# EAGLE design M7075X (EAGLE 6.6.0)
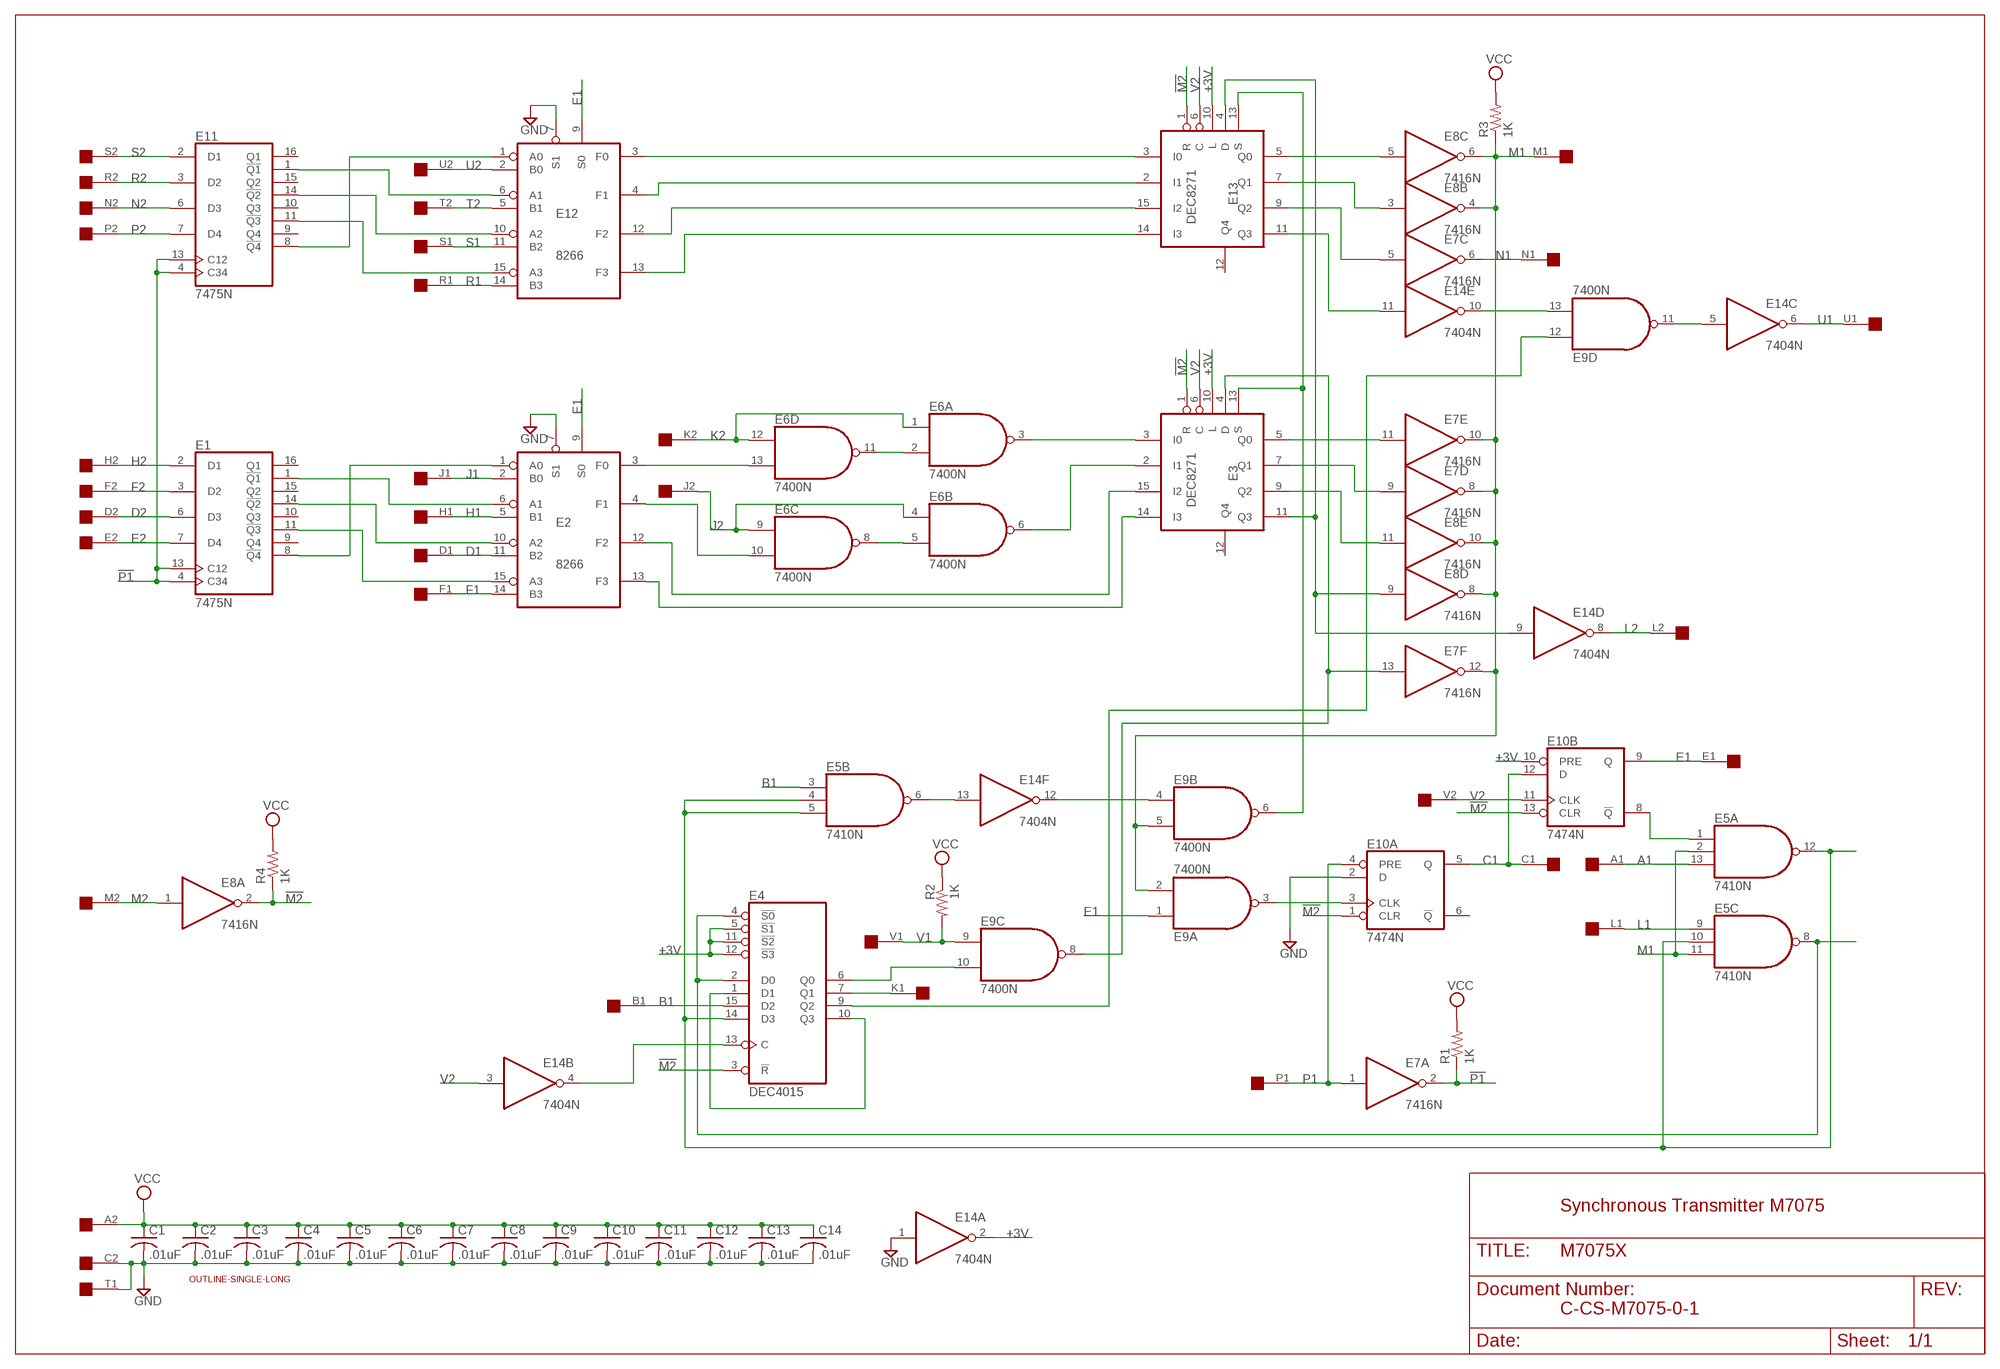
[diagram p0: schematic, sheet 1]

## Parts
C1  .01uF  C-US050-025X075  [C050-025X075]
C2  .01uF  C-US050-025X075  [C050-025X075]
C3  .01uF  C-US050-025X075  [C050-025X075]
C4  .01uF  C-US050-025X075  [C050-025X075]
C5  .01uF  C-US050-025X075  [C050-025X075]
C6  .01uF  C-US050-025X075  [C050-025X075]
C7  .01uF  C-US050-025X075  [C050-025X075]
C8  .01uF  C-US050-025X075  [C050-025X075]
C9  .01uF  C-US050-025X075  [C050-025X075]
C10  .01uF  C-US050-025X075  [C050-025X075]
C11  .01uF  C-US050-025X075  [C050-025X075]
C12  .01uF  C-US050-025X075  [C050-025X075]
C13  .01uF  C-US050-025X075  [C050-025X075]
C14  .01uF  C-US050-025X075  [C050-025X075]
E1  7475N  [DIL16]
E2  8266  [DIL16]
E3  DEC8271  [DIL16]
E4  DEC4015  [DIL16]
E5  7410N  [DIL14]
E6  7400N  [DIL14]
E7  7416N  [DIL14]
E8  7416N  [DIL14]
E9  7400N  [DIL14]
E10  7474N  74S74N  [DIL14]
E11  7475N  [DIL16]
E12  8266  [DIL16]
E13  DEC8271  [DIL16]
E14  7404N  [DIL14]
R1  1K  R-US_0207/10  [0207/10]
R2  1K  R-US_0207/10  [0207/10]
R3  1K  R-US_0207/10  [0207/10]
R4  1K  R-US_0207/10  [0207/10]
U$1  OUTLINE-SINGLE-LONG  [SINGLE-LONG]
U$2  SINGLE  [EDGE-CON2]

## Nets
!M2: E3.1(R) E4.3(!R) E8.2(A:O) E10.1(A:CLR) E10.13(B:CLR) E13.1(R) R4.1
!P1: E1.4(C34) E1.13(C12) E7.2(A:O) E11.4(C34) E11.13(C12) R1.1
+3V: E3.10(L) E4.5(!S1) E4.11(!S2) E4.12(!S3) E10.10(B:PRE) E13.10(L) E14.2(A:O)
A1: E5.13(A:I2) U$2.A1
B1: E4.15(D2) E5.3(B:I0) U$2.B1
C1: E10.5(A:Q) E10.12(B:D) U$2.C1
D1: E2.11(B2) U$2.D1
D2: E1.6(D3) U$2.D2
E1: E2.9(S0) E9.1(A:I0) E10.9(B:Q) E12.9(S0) U$2.E1
E2: E1.7(D4) U$2.E2
F1: E2.14(B3) U$2.F1
F2: E1.3(D2) U$2.F2
GND [supply]: C1.2 C2.2 C3.2 C4.2 C5.2 C6.2 C7.2 C8.2 C9.2 C10.2 C11.2 C12.2 C13.2 C14.2 E2.7(S1) E10.2(A:D) E12.7(S1) E14.1(A:I) U$2.C2 U$2.T1
H1: E2.5(B1) U$2.H1
H2: E1.2(D1) U$2.H2
J1: E2.2(B0) U$2.J1
J2: E6.4(B:I0) E6.9(C:I0) U$2.J2
K1: E4.7(Q1) U$2.K1
K2: E6.1(A:I0) E6.12(D:I0) U$2.K2
L1: E5.9(C:I0) U$2.L1
L2: E14.8(D:O) U$2.L2
M1: E5.2(A:I1) E5.11(C:I2) E7.8(D:O) E7.10(E:O) E7.12(F:O) E8.4(B:O) E8.6(C:O) E8.8(D:O) E8.10(E:O) E9.2(A:I1) E9.5(B:I1) R3.1 U$2.M1
M2: E8.1(A:I) U$2.M2
N1: E7.6(C:O) U$2.N1
N2: E11.6(D3) U$2.N2
N$3: E11.11(!Q3) E12.15(A3)
N$20: E2.3(F0) E6.13(D:I1)
N$21: E12.3(F0) E13.3(I0)
N$27: E1.11(!Q3) E2.15(A3)
N$29: E1.14(!Q2) E2.10(A2)
N$31: E12.4(F1) E13.2(I1)
N$32: E1.8(!Q4) E2.1(A0)
N$34: E12.13(F3) E13.14(I3)
N$35: E2.4(F1) E6.10(C:I1)
N$36: E12.12(F2) E13.15(I2)
N$38: E3.9(Q2) E8.11(E:I)
N$39: E8.5(C:I) E13.5(Q0)
N$41: E8.3(B:I) E13.7(Q1)
N$42: E3.11(Q3) E8.9(D:I) E13.4(D) E14.9(D:I)
N$50: E3.7(Q1) E7.9(D:I)
N$51: E7.5(C:I) E13.9(Q2)
N$52: E3.5(Q0) E7.11(E:I)
N$54: E3.4(D) E7.13(F:I) E9.8(C:O)
N$67: E5.1(A:I0) E10.8(B:!Q)
N$69: E9.3(A:O) E10.3(A:CLK)
N$74: E3.13(S) E9.6(B:O) E13.13(S)
N$76: E9.4(B:I0) E14.12(F:O)
N$80: E9.11(D:O) E14.5(C:I)
N$81: E9.13(D:I1) E14.10(E:O)
N$82: E4.9(Q2) E9.12(D:I0)
N$84: E4.6(Q0) E9.10(C:I1)
N$86: E4.14(D3) E5.4(B:I1) E5.5(B:I2) E5.10(C:I1) E5.12(A:O)
N$91: E4.13(C) E14.4(B:O)
N$92: E4.1(D1) E4.10(Q3)
N$99: E5.6(B:O) E14.13(F:I)
N$101: E13.11(Q3) E14.11(E:I)
N$115: E4.2(D0) E4.4(!S0) E5.8(C:O)
N$123: E11.14(!Q2) E12.10(A2)
N$125: E11.1(!Q1) E12.6(A1)
N$129: E6.5(B:I1) E6.8(C:O)
N$132: E6.2(A:I1) E6.11(D:O)
N$133: E3.3(I0) E6.3(A:O)
N$136: E3.2(I1) E6.6(B:O)
N$152: E2.13(F3) E3.14(I3)
N$153: E2.12(F2) E3.15(I2)
P1: E7.1(A:I) E10.4(A:PRE) U$2.P1
P2: E11.7(D4) U$2.P2
R1: E12.14(B3) U$2.R1
R2: E11.3(D2) U$2.R2
S1: E12.11(B2) U$2.S1
S2: E11.2(D1) U$2.S2
S$1: E11.8(!Q4) E12.1(A0)
S$4: E1.1(!Q1) E2.6(A1)
T2: E12.5(B1) U$2.T2
U1: E14.6(C:O) U$2.U1
U2: E12.2(B0) U$2.U2
V1: E9.9(C:I0) R2.2 U$2.V1
V2: E3.6(C) E10.11(B:CLK) E13.6(C) E14.3(B:I) U$2.V2
VCC [supply]: C1.1 C2.1 C3.1 C4.1 C5.1 C6.1 C7.1 C8.1 C9.1 C10.1 C11.1 C12.1 C13.1 C14.1 R1.2 R2.1 R3.2 R4.2 U$2.A2
Unconnected: E1.9(Q4) E1.10(Q3) E1.15(Q2) E1.16(Q1) E3.12(Q4) E7.3(B:I) E7.4(B:O) E8.12(F:O) E8.13(F:I) E10.6(A:!Q) E11.9(Q4) E11.10(Q3) E11.15(Q2) E11.16(Q1) E13.12(Q4) U$2.B2

## Notes on the sheet
- Synchronous Transmitter M7075
- C-CS-M7075-0-1

## Power pins joined to a net without a drawn wire
GND: E1.12(GND) E2.8(GND) E3.8(GND) E4.8(GND) E5.7(P:GND) E6.7(P:GND) E7.7(P:GND) E8.7(P:GND) E9.7(P:GND) E10.7(P:GND) E11.12(GND) E12.8(GND) E13.8(GND) E14.7(P:GND)
VCC: E1.5(VCC) E2.16(VCC) E3.16(VCC) E4.16(VCC) E5.14(P:VCC) E6.14(P:VCC) E7.14(P:VCC) E8.14(P:VCC) E9.14(P:VCC) E10.14(P:VCC) E11.5(VCC) E12.16(VCC) E13.16(VCC) E14.14(P:VCC)

## Library data of the parts
C1-C14 = rcl:C-US: CAPACITOR, American symbol
E1 E11 = 74xx-us:74*75: 4-bit bistable LATCH
E2 E12 = dec-con:8266: Quad 2-1 selector
E3 E13 = dec-con:DEC8271: Parallel Load Shift Register
E4 = dec-con:DEC4015: Quad latch, used in early DEC boards.
E5 = 74xx-us:74*10: Triple 3-input NAND gate
E6 E9 = 74xx-us:74*00: Quad 2-input NAND gate
E7 E8 = 74xx-us:74*16: Hex INVERTER, open collector, high-voltage
E10 = 74xx-us:74*74: Dual D type positive edge triggered FLIP FLOP, preset and clear
E14 = 74xx-us:74*04: Hex INVERTER
R1-R4 = rcl:R-US_: RESISTOR, American symbol
U$1 = dec-con:OUTLINE-*: Board outlines for DEC boards.
U$2 = dec-con:SINGLE: Single-Height DEC board

## Net classes
1 supply: width 0.813 mm

## Board
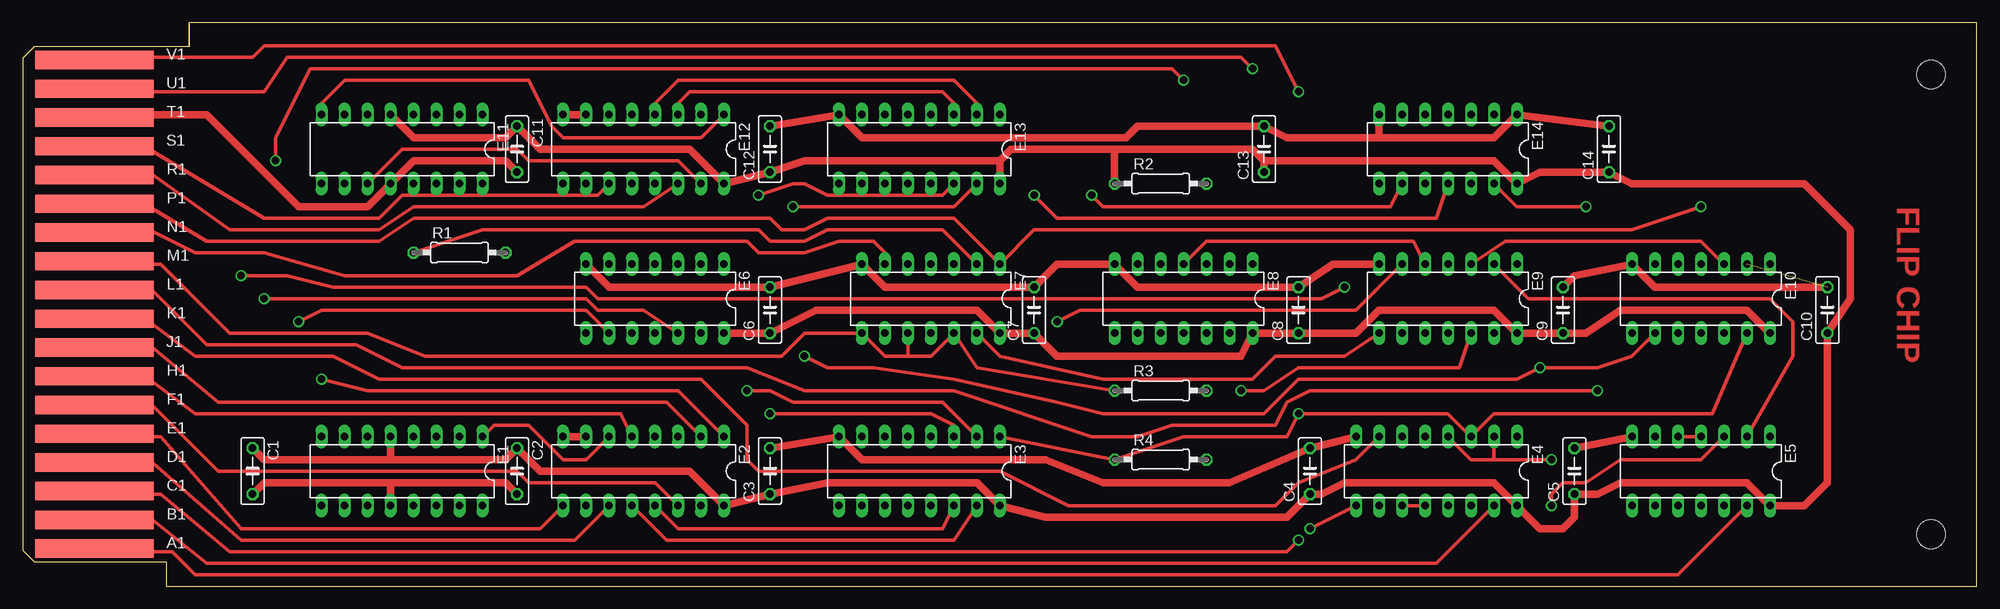
[diagram p1: board, top side]
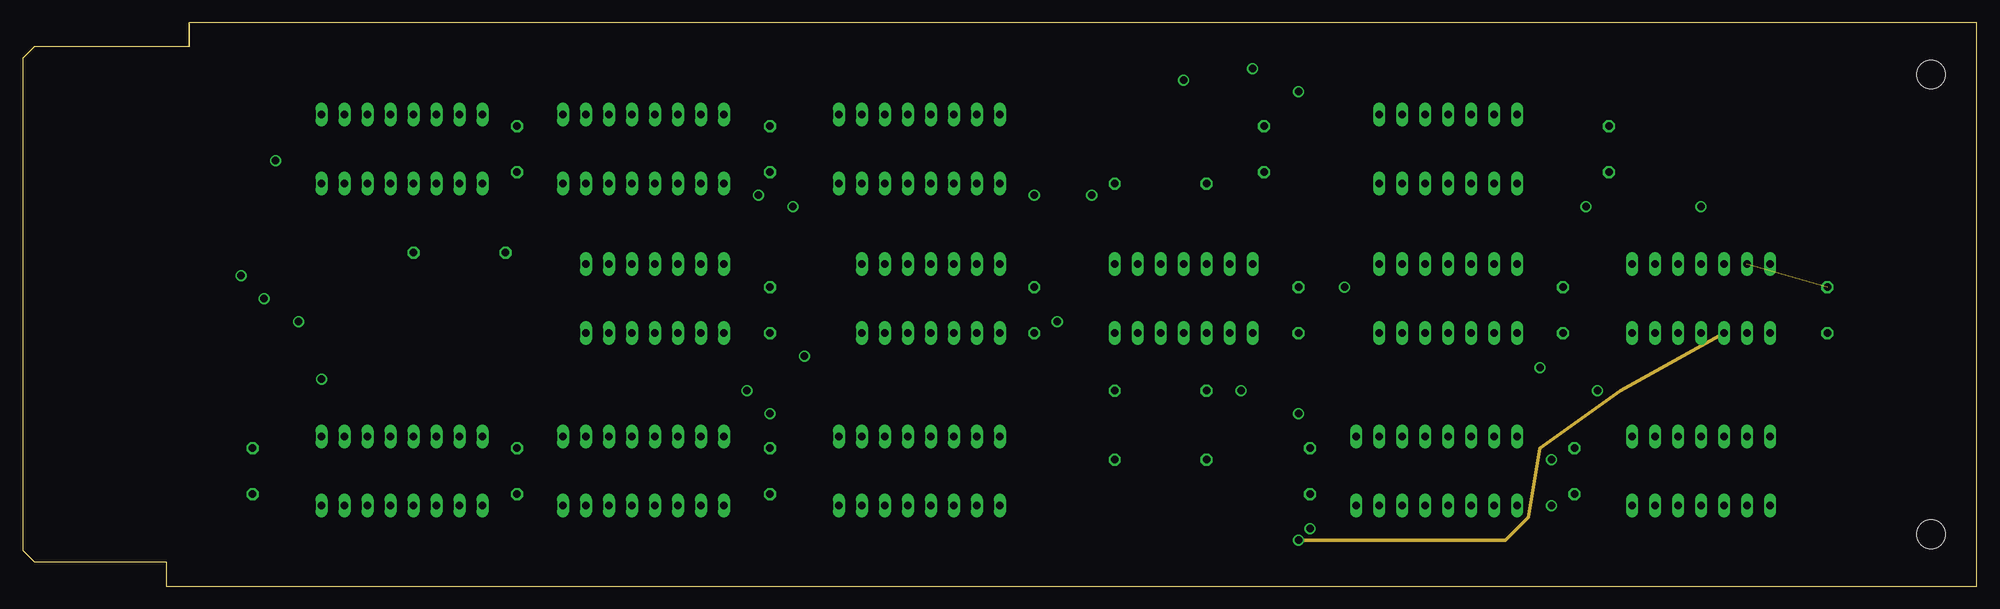
[diagram p2: board, inner layer ECO]
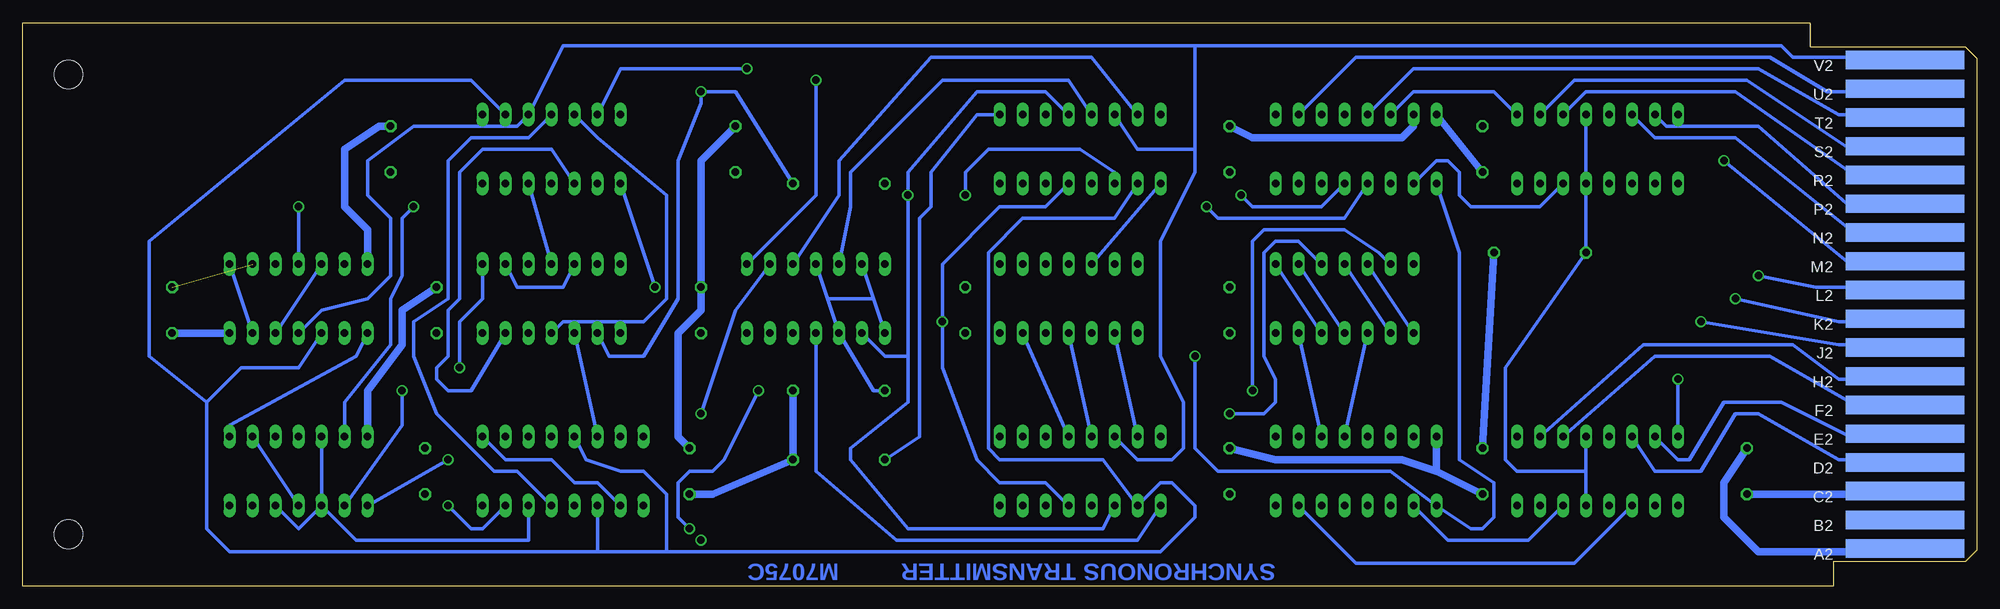
[diagram p3: board, bottom side, seen from below]

Size 215.9 x 62.23 mm. Coordinates in mm from the lower left corner, seen from the top.
Copper layers (1+2+16): Top 0.035mm / dielectric 1.5mm / ECO 0.035mm / dielectric 0.15mm / Bottom 0.035mm
Design rules "16mils *": minimum track width 16mil, minimum drill 32mil, track to track 15mil, track to pad 10mil, pad to pad 10mil, via to via 10mil, smd to smd 10mil, copper to edge 13mil, drill to drill 10mil, minimum pad ring 10mil, minimum via ring 8mil, stop-mask expansion 0mil, vias tented up to drill 0mil, thermal gap 10mil

### Footprints (pad centres in the part's own frame; a part is rotated, then mirrored left to right if it is on the bottom)
C050-025X075 = drill 0.813 octagon: 1 -2.54,0; 2 2.54,0
DIL16 = drill 0.813 long: 1 -8.89,-3.81; 2 -6.35,-3.81; 3 -3.81,-3.81; 4 -1.27,-3.81; 5 1.27,-3.81; 6 3.81,-3.81; 7 6.35,-3.81; 8 8.89,-3.81; 9 8.89,3.81; 10 6.35,3.81; 11 3.81,3.81; 12 1.27,3.81; 13 -1.27,3.81; 14 -3.81,3.81; 15 -6.35,3.81; 16 -8.89,3.81
DIL14 = drill 0.813 long: 1 -7.62,-3.81; 2 -5.08,-3.81; 3 -2.54,-3.81; 4 0,-3.81; 5 2.54,-3.81; 6 5.08,-3.81; 7 7.62,-3.81; 8 7.62,3.81; 9 5.08,3.81; 10 2.54,3.81; 11 0,3.81; 12 -2.54,3.81; 13 -5.08,3.81; 14 -7.62,3.81
0207/10 = drill 0.813 octagon: 1 -5.08,0; 2 5.08,0
SINGLE-LONG = hole 3.175: 210.82,56.515; 210.82,5.715
EDGE-CON2 = smd 13.106 x 2.032: A1 7.938,4.128; B1 7.938,7.303; C1 7.938,10.477; D1 7.938,13.652; E1 7.938,16.828; F1 7.938,20.003; H1 7.938,23.177; J1 7.938,26.352; K1 7.938,29.527; L1 7.938,32.703; M1 7.938,35.877; N1 7.938,39.053; P1 7.938,42.227; R1 7.938,45.403; S1 7.938,48.578; T1 7.938,51.752; U1 7.938,54.928; V1 7.938,58.102 | smd 13.106 x 2.032 bottom: A2 7.938,4.128; B2 7.938,7.303; C2 7.938,10.477; D2 7.938,13.652; E2 7.938,16.828; F2 7.938,20.003; H2 7.938,23.177; J2 7.938,26.352; K2 7.938,29.527; L2 7.938,32.703; M2 7.938,35.877; N2 7.938,39.053; P2 7.938,42.227; R2 7.938,45.403; S2 7.938,48.578; T2 7.938,51.752; U2 7.938,54.928; V2 7.938,58.102

### Placement (x,y rotation side)
C1  25.4,12.7 270 top
C2  54.61,12.7 270 top
C3  82.55,12.7 90 top
C4  142.24,12.7 90 top
C5  171.45,12.7 90 top
C6  82.55,30.48 90 top
C7  111.76,30.48 90 top
C8  140.97,30.48 90 top
C9  170.18,30.48 90 top
C10  199.39,30.48 90 top
C11  54.61,48.26 270 top
C12  82.55,48.26 90 top
C13  137.16,48.26 90 top
C14  175.26,48.26 90 top
E1  41.91,12.7 180 top
E2  68.58,12.7 180 top
E3  99.06,12.7 180 top
E4  156.21,12.7 180 top
E5  185.42,12.7 180 top
E6  69.85,31.75 180 top
E7  100.33,31.75 180 top
E8  128.27,31.75 180 top
E9  157.48,31.75 180 top
E10  185.42,31.75 180 top
E11  41.91,48.26 180 top
E12  68.58,48.26 180 top
E13  99.06,48.26 180 top
E14  157.48,48.26 180 top
R1  48.26,36.83 0 top
R2  125.73,44.45 0 top
R3  125.73,21.59 0 top
R4  125.73,13.97 0 top
U$1  0,0 0 top
U$2  0,0 0 top

### Tracks (layer width: path | path; a pad name or v marks a point on that pad's centre or on a via)
!M2  (via drill 0.81)
  Top 0.406: E10.13 186.69,19.05 162.56,19.05 E4.3 157.48,19.05 v140.97,19.05 139.7,16.51 128.27,16.51 R4.1 E3.1
  Bottom 0.406: E8.2 137.16,30.48 v140.97,19.05 | E10.1 E10.13 | E13.1 110.49,52.07 115.57,45.72 115.57,41.91 116.84,40.64 116.84,16.51 R4.1
!P1
  Top 0.406: E7.2 101.6,39.37 88.9,39.37 86.36,38.1 82.55,38.1 81.28,39.37 50.8,39.37 R1.1
  Bottom 0.406: E11.4 E11.13 R1.1 52.07,24.13 52.07,13.97 50.8,12.7 43.18,12.7 | E1.4 43.18,12.7 | 43.18,12.7 E1.13
+3V
  Top 0.406: E4.11 E4.12
  Bottom 0.406: E14.2 166.37,55.88 180.34,55.88 201.93,38.1 201.93,25.4 195.58,20.32 | 195.58,20.32 191.77,24.13 185.42,24.13 E10.10 | 195.58,20.32 195.58,6.35 193.04,3.81 152.4,3.81 | 152.4,3.81 E4.11 | 152.4,3.81 144.78,3.81 | 144.78,3.81 144.78,10.16 147.32,12.7 149.86,12.7 153.67,13.97 E4.5 | 144.78,3.81 90.17,3.81 86.36,7.62 86.36,8.89 88.9,11.43 90.17,11.43 E3.10 96.52,13.97 107.95,13.97 109.22,15.24 109.22,36.83 105.41,40.64 95.25,40.64 E13.10
A1
  Top 0.406: U$2.A1 8.89,3.81 16.51,3.81 19.05,1.27 182.88,1.27 E5.13
B1  (via drill 0.81)
  Top 0.406: U$2.B1 13.97,7.62 20.32,2.54 156.21,2.54 E4.15 | v168.91,8.89 168.91,10.16 170.18,11.43 172.72,11.43 176.53,13.97 185.42,13.97 E5.3
  Bottom 0.406: E4.15 165.1,6.35 166.37,6.35 v168.91,8.89
C1  (via drill 0.81)
  Top 0.406: U$2.C1 8.89,10.16 15.24,10.16 22.86,3.81 139.7,3.81 v140.97,5.08
  ECO 0.406: v140.97,5.08 163.83,5.08 166.37,7.62 167.64,15.24 176.53,21.59 E10.12
  Bottom 0.406: E10.5 E10.12
D1
  Top 0.406: U$2.D1 8.89,13.97 13.97,13.97 24.13,5.08 60.96,5.08 E2.11
D2
  Bottom 0.406: E1.6 35.56,12.7 30.48,12.7 26.67,19.05 24.13,19.05 15.24,13.97 8.89,13.97 U$2.D2
E1  (via drill 0.81)
  Top 0.406: U$2.E1 8.89,16.51 15.24,16.51 24.13,6.35 57.15,6.35 E2.9 | v86.36,25.4 88.9,24.13 93.98,24.13 102.87,22.86 114.3,20.32 119.38,19.05 137.16,19.05 140.97,22.86 165.1,22.86 v167.64,24.13 173.99,24.13 177.8,25.4 E10.9
  Bottom 0.406: v86.36,25.4 86.36,15.24 83.82,12.7 64.77,12.7 E2.9 55.88,6.35 54.61,6.35 53.34,7.62 53.34,11.43 57.15,13.97 57.15,36.83 E12.9 | E9.1 165.1,31.75 167.64,29.21 v167.64,24.13
E2
  Bottom 0.406: E1.7 33.02,13.97 31.75,13.97 27.94,20.32 21.59,20.32 13.97,16.51 8.89,16.51 U$2.E2
F1
  Top 0.406: U$2.F1 8.89,20.32 13.97,20.32 21.59,12.7 54.61,12.7 55.88,11.43 69.85,11.43 E2.14
F2
  Bottom 0.406: E1.3 35.56,25.4 22.86,25.4 13.97,20.32 8.89,20.32 U$2.F2
GND  (1 unrouted)
  Top 0.813: E12.8 E12.7 | C1.2 26.67,11.43 40.64,11.43 | 40.64,11.43 E1.12 | C2.2 53.34,11.43 40.64,11.43 | E2.8 E2.7 | U$2.T1 8.89,52.07 20.32,52.07 30.48,41.91 38.1,41.91 E11.12 43.18,46.99 53.34,46.99 C11.2 | C12.2 E13.8 92.71,49.53 121.92,49.53 123.19,50.8 C13.2 139.7,49.53 149.86,49.53 | C3.2 E3.8 92.71,13.97 113.03,13.97 119.38,11.43 133.35,11.43 C4.2 E4.8 | C14.2 E14.1 162.56,49.53 149.86,49.53 | E9.7 144.78,35.56 C8.2 123.19,33.02 E8.7 114.3,35.56 C7.2 95.25,33.02 E7.7 C6.2 64.77,33.02 E6.7 | C9.2 171.45,34.29 E10.7 180.34,33.02 C10.2 | C5.2 E5.7 | E14.7 149.86,49.53
  Bottom 0.813: U$2.C2 8.89,10.48 8.89,10.16 C1.2 | C2.2 59.69,12.7 | 59.69,12.7 63.5,13.97 77.47,13.97 C3.2 | E2.8 59.69,12.7 | C11.2 E12.8 | E12.7 62.23,50.8 63.5,49.53 80.01,49.53 C12.2 | C13.2 140.97,46.99 C8.2 140.97,30.48 143.51,27.94 143.51,16.51 C4.2 | C14.2 176.53,50.8 180.34,48.26 180.34,41.91 177.8,39.37 E10.7 | C9.2 173.99,30.48 173.99,26.67 177.8,21.59 E5.7
H1
  Top 0.406: E2.5 66.04,19.05 19.05,19.05 13.97,22.86 8.89,22.86 U$2.H1
H2
  Bottom 0.406: E1.2 36.83,26.67 20.32,26.67 15.24,22.86 8.89,22.86 U$2.H2
J1
  Top 0.406: E2.2 71.12,20.32 21.59,20.32 13.97,26.67 8.89,26.67 U$2.J1
J2  (via drill 0.81)
  Top 0.406: v30.48,29.21 33.02,30.48 62.23,30.48 E6.9
  Bottom 0.406: U$2.J2 8.89,26.67 15.24,26.67 v30.48,29.21 | E6.4 E6.9
K1
  Top 0.406: U$2.K1 8.89,29.21 13.97,29.21 19.05,25.4 34.29,25.4 39.37,22.86 74.93,22.86 80.01,17.78 80.01,13.97 81.28,12.7 107.95,12.7 115.57,8.89 138.43,8.89 140.97,11.43 147.32,13.97 E4.7
K2  (via drill 0.81)
  Top 0.406: v26.67,31.75 62.23,31.75 63.5,30.48 68.58,30.48 E6.12
  Bottom 0.406: U$2.K2 8.89,29.21 15.24,29.21 v26.67,31.75 | E6.1 E6.12
L1  (via drill 0.81)
  Top 0.406: U$2.L1 8.89,33.02 13.97,33.02 20.32,26.67 36.83,26.67 41.91,24.13 80.01,24.13 86.36,21.59 102.87,21.59 118.11,16.51 123.19,16.51 127,17.78 138.43,17.78 139.7,20.32 142.24,21.59 v173.99,21.59
  Bottom 0.406: E5.9 173.99,17.78 v173.99,21.59
L2  (via drill 0.81)
  Top 0.406: v24.13,34.29 29.21,34.29 34.29,33.02 62.23,33.02 63.5,31.75 143.51,31.75 v146.05,33.02
  Bottom 0.406: U$2.L2 8.89,33.02 17.78,33.02 v24.13,34.29 | E14.8 v146.05,33.02
M1
  Top 0.406: 97.79,25.4 95.25,25.4 E7.8 86.36,27.94 83.82,25.4 44.45,25.4 38.1,27.94 22.86,27.94 15.24,35.56 8.89,35.56 U$2.M1 | 97.79,25.4 E7.10 | 97.79,25.4 100.33,25.4 E7.12 105.41,24.13 R3.1 | E8.4 130.81,38.1 153.67,38.1 E9.5 | E9.2 166.37,31.75 193.04,31.75 195.58,29.21 195.58,25.4 E5.2
  Bottom 0.406: E8.8 121.92,31.75 | 121.92,31.75 E8.6 | 121.92,31.75 127,31.75 | 127,31.75 E8.4 | R3.1 121.92,21.59 E8.10 127,31.75 | E9.5 156.21,33.02 161.29,33.02 E9.2 | E5.2 E5.11
M2  (via drill 0.81)
  Top 0.406: v27.94,46.99 27.94,49.53 31.75,57.15 127,57.15 v128.27,55.88
  Bottom 0.406: v27.94,46.99 13.97,35.56 8.89,35.56 U$2.M2 | E8.1 128.27,43.18 v128.27,55.88
N1
  Top 0.406: E7.6 95.25,36.83 93.98,38.1 90.17,38.1 86.36,36.83 81.28,36.83 80.01,38.1 60.96,38.1 54.61,34.29 35.56,34.29 26.67,36.83 19.05,36.83 13.97,39.37 8.89,39.37 U$2.N1
N2
  Bottom 0.406: E11.6 35.56,49.53 26.67,49.53 13.97,39.37 8.89,39.37 U$2.N2
N$3
  Top 0.406: E12.15 72.39,46.99 55.88,46.99 54.61,48.26 41.91,48.26 E11.11
N$20
  Bottom 0.406: E2.3 E6.13
N$21
  Top 0.406: E12.3 72.39,53.34 73.66,54.61 101.6,54.61 102.87,53.34 E13.3
N$27
  Bottom 0.406: E1.11 44.45,2.54 68.58,2.54 E2.15
N$29
  Bottom 0.406: E1.14 49.53,5.08 58.42,5.08 E2.10
N$31
  Top 0.406: E12.4 69.85,53.34 72.39,55.88 102.87,55.88 105.41,53.34 E13.2
N$32  (via drill 0.81)
  Top 0.406: E2.1 72.39,21.59 38.1,21.59 v33.02,22.86
  Bottom 0.406: E1.8 v33.02,22.86
N$34  (via drill 0.81)
  Top 0.406: v81.28,43.18 85.09,44.45 86.36,44.45 88.9,43.18 101.6,43.18 E13.14
  Bottom 0.406: E12.13 72.39,41.91 80.01,41.91 v81.28,43.18
N$35
  Bottom 0.406: E6.10 E2.4
N$36  (via drill 0.81)
  Top 0.406: v85.09,41.91 102.87,41.91 E13.15
  Bottom 0.406: E12.12 69.85,40.64 83.82,40.64 v85.09,41.91
N$38
  Bottom 0.406: E3.9 92.71,5.08 119.38,5.08 128.27,12.7 E8.11
N$39
  Bottom 0.406: E8.5 124.46,41.91 124.46,45.72 114.3,55.88 100.33,55.88 E13.5
N$41
  Bottom 0.406: E8.3 125.73,43.18 125.73,46.99 115.57,58.42 97.79,58.42 E13.7
N$42  (via drill 0.81)
  Top 0.406: v118.11,43.18 119.38,41.91 151.13,41.91 E14.9
  Bottom 0.406: E8.9 120.65,25.4 118.11,25.4 | 118.11,25.4 118.11,20.32 124.46,15.24 124.46,13.97 118.11,6.35 96.52,6.35 E3.11 | E13.4 102.87,54.61 110.49,54.61 118.11,45.72 v118.11,43.18 118.11,25.4
N$50
  Bottom 0.406: E7.9 E3.7
N$51
  Bottom 0.406: E13.9 E7.5
N$52
  Bottom 0.406: E7.11 E3.5
N$54
  Top 0.406: E9.8 146.05,25.4 138.43,25.4 135.89,22.86 119.38,22.86 107.95,25.4 E7.13
  Bottom 0.406: E7.13 E3.4
N$67
  Bottom 0.406: E5.1 193.04,17.78 179.07,25.4 E10.8
N$69
  Top 0.406: E10.3 185.42,38.1 163.83,38.1 E9.3
N$74  (via drill 0.81)
  Top 0.406: E9.6 147.32,30.48 116.84,30.48 v114.3,29.21
  Bottom 0.406: E13.13 102.87,41.91 107.95,41.91 114.3,35.56 v114.3,29.21 114.3,24.13 110.49,13.97 107.95,11.43 102.87,11.43 E3.13
N$76
  Bottom 0.406: E9.4 E14.12
N$80
  Bottom 0.406: E9.11 156.21,29.21 147.32,29.21 144.78,31.75 144.78,43.18 152.4,49.53 E14.5
N$81
  Bottom 0.406: E14.10 157.48,48.26 165.1,48.26 167.64,45.72 167.64,31.75 168.91,30.48 168.91,25.4 170.18,24.13 170.18,22.86 168.91,21.59 166.37,21.59 E9.13
N$82  (via drill 0.81)
  Top 0.406: v142.24,6.35 E4.9 | v134.62,21.59 137.16,21.59 140.97,24.13 158.75,24.13 E9.12
  Bottom 0.406: v134.62,21.59 138.43,13.97 139.7,12.7 142.24,12.7 143.51,11.43 143.51,7.62 v142.24,6.35
N$84
  Bottom 0.406: E4.6 E9.10
N$86
  Top 0.406: E5.5 E5.4
  Bottom 0.406: E4.14 160.02,5.08 179.07,5.08 E5.10 | E5.10 185.42,6.35 E5.12 | E5.5 E5.10
N$91
  Bottom 0.406: E4.13 161.29,12.7 163.83,12.7 170.18,19.05 172.72,25.4 172.72,29.21 168.91,31.75 168.91,46.99 166.37,49.53 160.02,49.53 E14.4
N$92
  Bottom 0.406: E4.10 152.4,11.43 154.94,11.43 157.48,13.97 162.56,13.97 E4.1
N$99  (via drill 0.81)
  Top 0.406: E14.13 165.1,41.91 v172.72,41.91
  Bottom 0.406: E5.6 180.34,20.32 175.26,26.67 175.26,31.75 173.99,34.29 173.99,40.64 v172.72,41.91
N$101  (via drill 0.81)
  Top 0.406: v111.76,43.18 114.3,40.64 156.21,40.64 E14.11
  Bottom 0.406: E13.11 95.25,45.72 99.06,48.26 109.22,48.26 111.76,45.72 v111.76,43.18
N$115  (via drill 0.81)
  Top 0.406: E4.2 162.56,13.97 | 162.56,13.97 160.02,13.97 E4.4 | 162.56,13.97 v168.91,13.97
  Bottom 0.406: E5.8 v168.91,13.97
N$123
  Bottom 0.406: E11.14 48.26,41.91 55.88,41.91 57.15,43.18 57.15,45.72 58.42,46.99 59.69,46.99 E12.10
N$125
  Bottom 0.406: E11.1 53.34,54.61 62.23,54.61 E12.6
N$129
  Bottom 0.406: E6.5 E6.8
N$132
  Bottom 0.406: E6.2 E6.11
N$133  (via drill 0.81)
  Top 0.406: v82.55,19.05 100.33,19.05 102.87,17.78 E3.3
  Bottom 0.406: E6.3 74.93,38.1 77.47,38.1 78.74,36.83 78.74,25.4 77.47,22.86 77.47,20.32 78.74,19.05 v82.55,19.05
N$136  (via drill 0.81)
  Top 0.406: v80.01,21.59 82.55,21.59 85.09,20.32 101.6,20.32 E3.2
  Bottom 0.406: E6.6 66.04,36.83 69.85,39.37 78.74,39.37 80.01,38.1 v80.01,21.59
N$152
  Top 0.406: E2.13 72.39,6.35 101.6,6.35 E3.14
N$153
  Top 0.406: E2.12 71.12,5.08 102.87,5.08 E3.15
P1  (via drill 0.81)
  Top 0.406: U$2.P1 8.89,41.91 13.97,41.91 20.32,38.1 39.37,38.1 43.18,40.64 82.55,40.64 83.82,39.37 86.36,39.37 88.9,40.64 102.87,40.64 E7.1 111.76,39.37 177.8,39.37 v185.42,41.91
  Bottom 0.406: E10.4 v185.42,41.91
P2
  Bottom 0.406: E11.7 34.29,50.8 24.13,50.8 13.97,41.91 8.89,41.91 U$2.P2
R1
  Top 0.406: E12.14 68.58,41.91 43.18,41.91 39.37,39.37 22.86,39.37 13.97,45.72 8.89,45.72 U$2.R1
R2
  Bottom 0.406: E11.3 43.18,54.61 26.67,54.61 13.97,45.72 8.89,45.72 U$2.R2
S1
  Top 0.406: E12.11 63.5,43.18 41.91,43.18 39.37,40.64 26.67,40.64 13.97,48.26 8.89,48.26 U$2.S1
S2
  Bottom 0.406: E11.2 44.45,55.88 25.4,55.88 13.97,48.26 8.89,48.26 U$2.S2
S$1
  Top 0.406: E11.8 33.02,53.34 35.56,55.88 55.88,55.88 58.42,50.8 59.69,49.53 74.93,49.53 E12.1
S$4
  Top 0.406: E1.1 52.07,17.78 55.88,17.78 59.69,13.97 62.23,13.97 E2.6
T2
  Bottom 0.406: U$2.T2 8.89,52.07 15.24,52.07 24.13,57.15 62.23,57.15 E12.5
U1  (via drill 0.81)
  Top 0.406: U$2.U1 8.89,54.61 26.67,54.61 29.21,58.42 134.62,58.42 v135.89,57.15
  Bottom 0.406: E14.6 149.86,57.15 v135.89,57.15
U2
  Bottom 0.406: U$2.U2 8.89,54.61 16.51,54.61 22.86,58.42 68.58,58.42 E12.2
V1  (via drill 0.81)
  Top 0.406: U$2.V1 8.89,58.42 25.4,58.42 26.67,59.69 138.43,59.69 v140.97,54.61
  Bottom 0.406: R2.2 137.16,54.61 v140.97,54.61 140.97,53.34 143.51,46.99 143.51,31.75 147.32,25.4 151.13,25.4 E9.9
V2
  Bottom 0.406: E3.6 92.71,13.97 88.9,13.97 87.63,15.24 87.63,20.32 90.17,25.4 90.17,38.1 86.36,45.72 86.36,48.26 | 86.36,48.26 86.36,59.69 | 86.36,59.69 21.59,59.69 20.32,58.42 8.89,58.42 U$2.V2 | 86.36,59.69 156.21,59.69 E14.3 161.29,50.8 172.72,50.8 177.8,46.99 177.8,43.18 175.26,40.64 175.26,34.29 177.8,31.75 182.88,30.48 E10.11 | E13.6 92.71,48.26 86.36,48.26
VCC
  Top 0.813: E6.14 C6.1 87.63,30.48 105.41,30.48 E7.14 C7.1 114.3,25.4 134.62,25.4 E8.14 C8.1 147.32,27.94 149.86,30.48 162.56,30.48 E9.14 C9.1 172.72,27.94 176.53,30.48 190.5,30.48 E10.14 | C1.1 26.67,13.97 40.64,13.97 | 40.64,13.97 E1.5 | 40.64,13.97 53.34,13.97 C2.1 57.15,12.7 73.66,12.7 E2.16 C3.1 88.9,11.43 105.41,11.43 E3.16 113.03,7.62 139.7,7.62 C4.1 143.51,10.16 146.05,11.43 162.56,11.43 E4.16 167.64,6.35 170.18,6.35 171.45,7.62 C5.1 173.99,10.16 176.53,11.43 190.5,11.43 E5.14 196.85,8.89 199.39,11.43 C10.1 201.93,31.75 201.93,39.37 196.85,44.45 177.8,44.45 C14.1 167.64,45.72 E14.14 162.56,46.99 137.16,46.99 | C13.1 137.16,46.99 | 137.16,46.99 135.89,48.26 120.65,48.26 | 120.65,48.26 109.22,48.26 107.95,46.99 | R2.1 120.65,48.26 | 107.95,46.99 86.36,46.99 C12.1 E12.16 73.66,48.26 57.15,48.26 C11.1 53.34,49.53 43.18,49.53 E11.5 | E13.16 107.95,46.99
  Bottom 0.813: U$2.A2 8.89,4.13 8.89,3.81 24.13,3.81 27.94,7.62 27.94,11.43 C1.1 | C2.1 R1.2 | R3.2 R4.2 139.7,10.16 C4.1 | E10.14 C10.1

### Text on the board
Top: FLIP CHIP
Bottom: SYNCHRONOUS TRANSMITTER | M7075C